# EAGLE design TML_Tick Tacho Timergrapher Mic v2 (EAGLE 9.6.2)
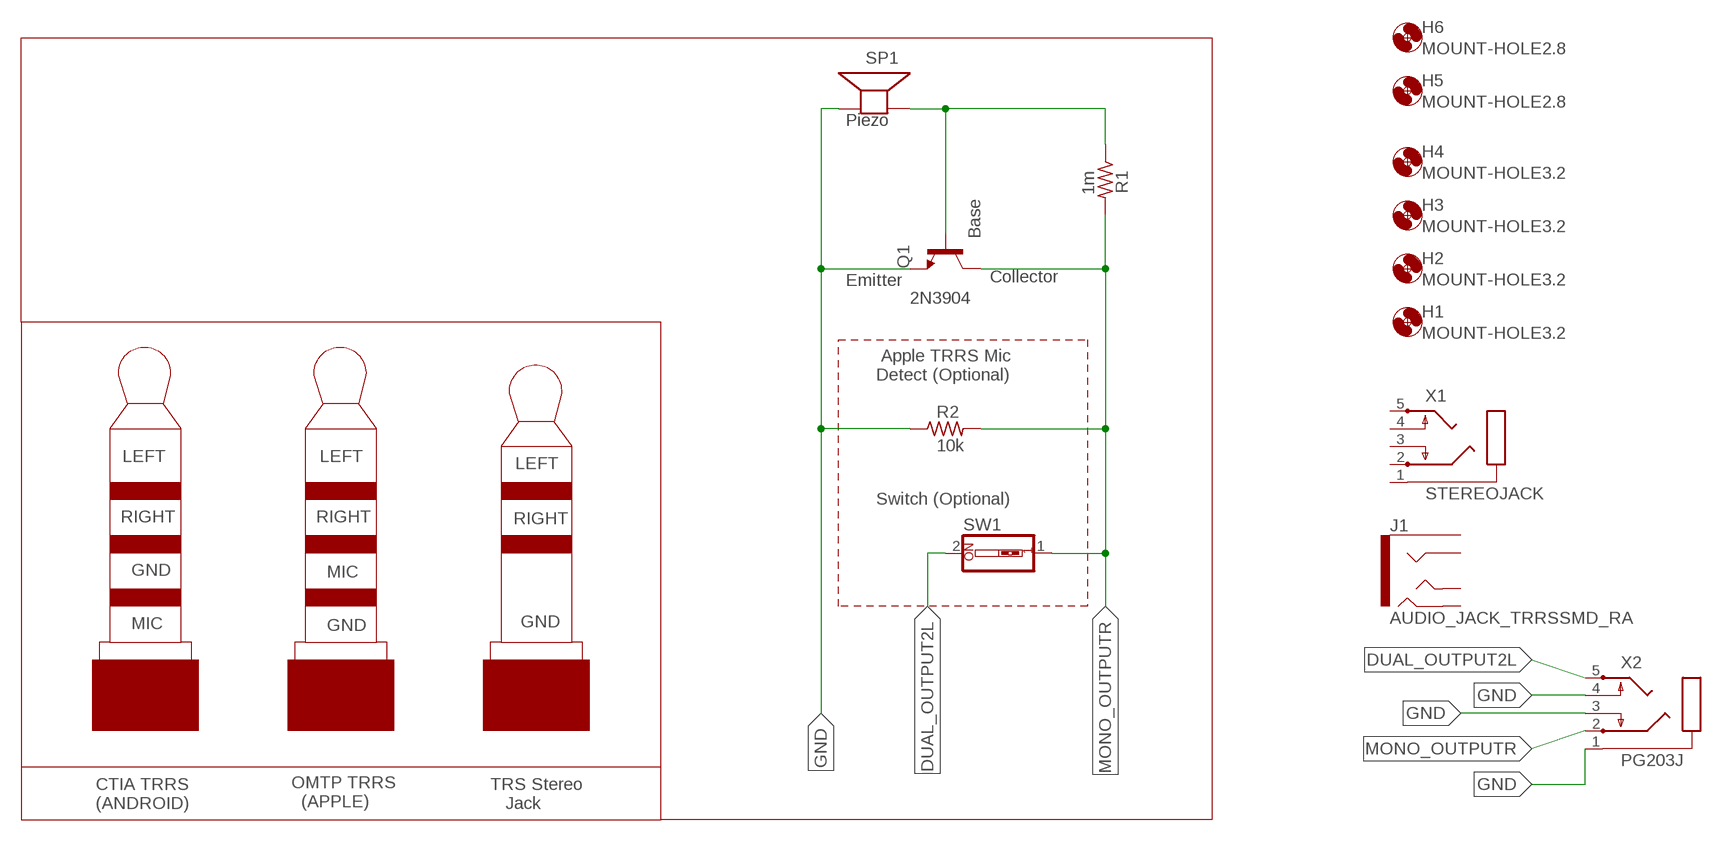
[diagram p0: schematic, sheet 1]

## Parts
H1  MOUNT-HOLE3.2  [3,2]
H2  MOUNT-HOLE3.2  [3,2]
H3  MOUNT-HOLE3.2  [3,2]
H4  MOUNT-HOLE3.2  [3,2]
H5  MOUNT-HOLE2.8  [2,8]
H6  MOUNT-HOLE2.8  [2,8]
J1  AUDIO_JACK_TRRSSMD_RA  [AUDIO_JACK_3.5MM_TRRS_SMD_RA]
Q1  2N3904  [TO92]
R1  1m  R-US_0204/7  [0204/7]
R2  10k  R-US_0204/7  [0204/7]
SP1  Piezo  SPEAKER/AL60P  [AL60P]
SW1  SW_DIP-1  [EDG-01]
X1  STEREOJACK  [STX3100]
X2  PG203J  [PG203J]

## Nets
DUAL_OUTPUT2L: SW1.2 X2.5
GND: Q1.3(E) R2.1 SP1.1(+) X2.1 X2.3 X2.4
MONO_OUTPUTR: Q1.1(C) R1.2 R2.2 SW1.1 X2.2
N$5: Q1.2(B) R1.1 SP1.2(-)
Unconnected: J1.EARTH J1.RING1 J1.RING2 J1.TIP X1.1 X1.2 X1.3 X1.4 X1.5

## Notes on the sheet
- Piezo
- Base
- Emitter | Collector
- Apple TRRS Mic 
  Detect (Optional)
- LEFT | LEFT
- LEFT
- Switch (Optional)
- RIGHT | RIGHT | RIGHT
- GND | MIC
- MIC | GND | GND
- OMTP TRRS
    (APPLE)
- CTIA TRRS
  (ANDROID)
- TRS Stereo 
     Jack

## Library data of the parts
H1-H6 = holes:MOUNT-HOLE: MOUNTING HOLE with drill center marker
J1 = SparkFun-Connectors:AUDIO_JACK_TRRS: Audio Jack - 3.5mm TRRS (SMD) This is a 3.5mm TRRS SMD audio jack. TRRS connectors are the audio-style connectors that you see on some phones, MP3 players and development boards. TRRS stands for “tip, ring, ring, sleeve,” which reflects that this has three conductors and a ground. SparkFun Products: Audio Jack <https://www.sparkfun.com/products/12639> mbed Starter Kit <https://www.sparkfun.com/products/12968> SparkFun TRRS 3.5mm Jack Breakout <https://www.sparkfun.com/products/11570>; PROD_ID: CONN-10676; SF_ID: PRT-12639
Q1 = transistor-npn:2N3904: NPN Transistor
R1 R2 = rcl:R-US_: RESISTOR, American symbol
SP1 = adafruit:SPEAKER: SPEAKER Source: Buerklin Added PS12 (for part # PS1240 piezo) http://www.ladyada.net/library/pcb/eaglelibrary.html
SW1 = special:SW_DIP-1: DIP SWITCH
X1 = adafruit:STEREOJACK: MIC/HEADPHONE JACK Stereo jack with two switches. Kycon STX3100, CUI SJ1-3555NG and/or 4UCon 05544
X2 = con-hirschmann:PG203J: MIC/HEADPHONE JACK KS-S stereo microphone/headphone jack PG203JN (Schukat); OC_FARNELL: unknown; OC_NEWARK: unknown

## Board
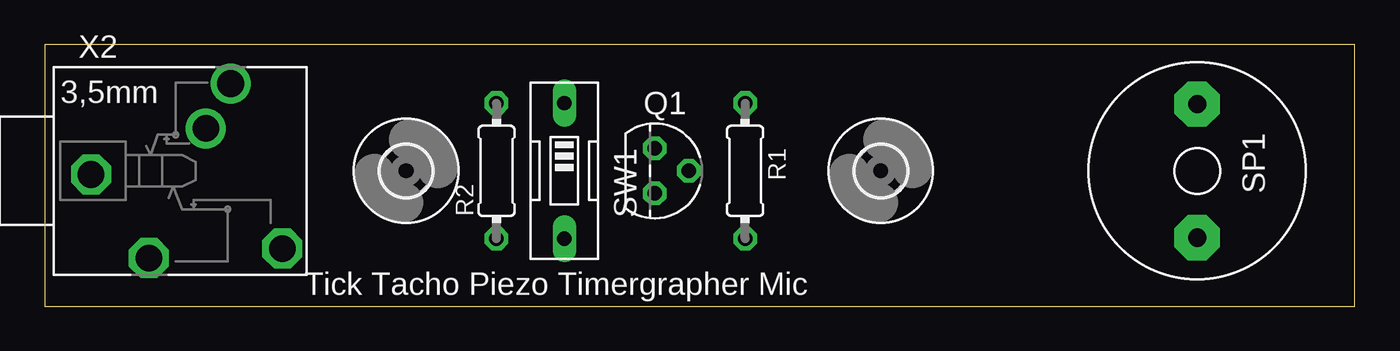
[diagram p1: board, top side]
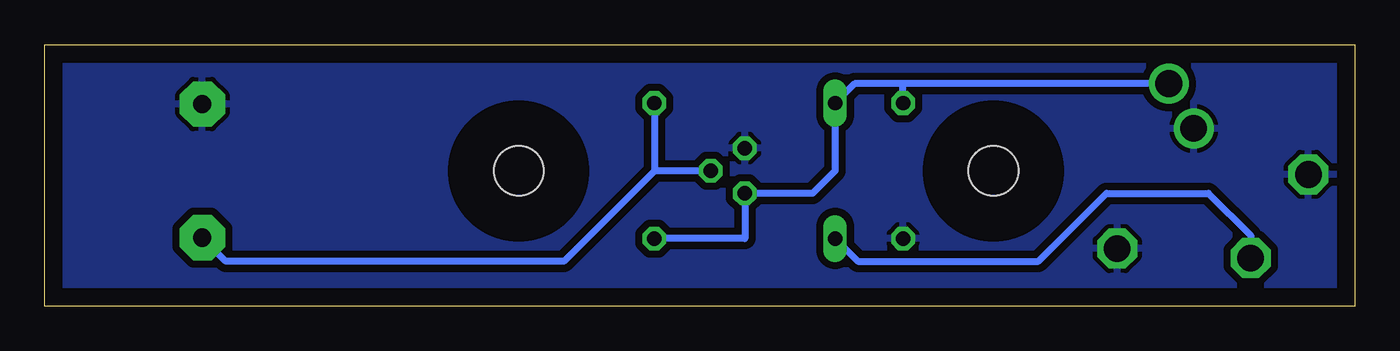
[diagram p2: board, bottom side, seen from below]

Size 73.64 x 14.73 mm. Coordinates in mm from the lower left corner, seen from the top.
Outline: 0,0 73.64,0 73.62,14.73 0,14.73 0,0
Copper layers (1*16): Top 0.035mm / dielectric 1.5mm / Bottom 0.035mm
Design rules "default": minimum track width 10mil, minimum drill 24mil, track to track 8mil, track to pad 8mil, pad to pad 8mil, via to via 8mil, smd to smd 8mil, copper to edge 40mil, drill to drill 8mil, minimum pad ring 10mil, minimum via ring 8mil, stop-mask expansion 4mil, vias tented up to drill 0mil, thermal gap 10mil

### Footprints (pad centres in the part's own frame; a part is rotated, then mirrored left to right if it is on the bottom)
3,2 = hole 3.2: 0,0
2,8 = hole 2.8: 0,0
AUDIO_JACK_3.5MM_TRRS_SMD_RA = smd 1.2 x 2.5: EARTH 11.3,-3.25; RING1 6.2,3.25; RING2 3.2,3.25; TIP 10.2,3.25 | hole 1.2: 1.6,0; 8.6,0
TO92 = drill 0.813 octagon: 1 1.27,0; 2 0,1.905; 3 -1.27,0
0204/7 = drill 0.813 octagon: 1 -3.81,0; 2 3.81,0
AL60P = drill 1.016 pad 2.54 octagon: 1 -3.759,0; 2 3.759,0
EDG-01 = drill 0.813 long: 1 0,-3.81; 2 0,3.81
STX3100 = drill 1.5 pad 2.54: 1 2.7,-0.1 | drill 1.5: 2 7.7,5; 3 7.7,2.3; 4 7.7,-2.5; 5 7.7,-5.2 | hole 1.5: 2.7,4.9; 2.7,-5.1; 7.7,-0.1
PG203J = drill 1.499 octagon: 1 -5.004,-0.203; 4 5.74,-4.369; 5 -1.753,-4.902 | drill 1.499: 2 2.845,4.902; 3 1.448,2.388

### Placement (x,y rotation side)
H1  19.05,-31.75 0 top  (outside the outline)
H2  20.32,-21.59 0 top  (outside the outline)
H3  10.16,-22.86 0 top  (outside the outline)
H4  10.16,-31.75 0 top  (outside the outline)
H5  46.99,7.62 0 top
H6  20.32,7.62 0 top
J1  -17.78,-21.59 0 top  (outside the outline)
Q1  34.29,7.62 270 top
R1  39.37,7.62 270 top
R2  25.4,7.62 90 top
SP1  64.77,7.62 270 top
SW1  29.21,7.62 180 top
X1  -31.75,-10.16 0 top  (outside the outline)
X2  7.62,7.62 0 top

### Tracks (layer width: path | path; a pad name or v marks a point on that pad's centre or on a via)
DUAL_OUTPUT2L
  Bottom 0.406: SW1.2 27.94,2.54 17.78,2.54 13.97,6.35 8.23,6.35 5.87,3.99 X2.5
GND
  pour Bottom (isolate 0.406): -1.27,15.24 74.93,15.24 74.93,-1.27 -1.27,-1.27
MONO_OUTPUTR
  Bottom 0.406: R1.2 34.29,3.81 Q1.1 30.48,6.35 29.21,7.62 SW1.1 28.12,12.52 25.4,12.52 | X2.2 25.4,12.52 | R2.2 25.4,12.52
N$5
  Bottom 0.406: Q1.2 39.37,7.62 | 39.37,7.62 44.45,2.54 63.45,2.54 SP1.2 | R1.1 39.37,7.62

### Text on the board
tPlace: Tick Tacho Piezo Timergrapher Mic